# EasyEDA Pro project ACDC_双向.eprj, board 全桥（SMC）
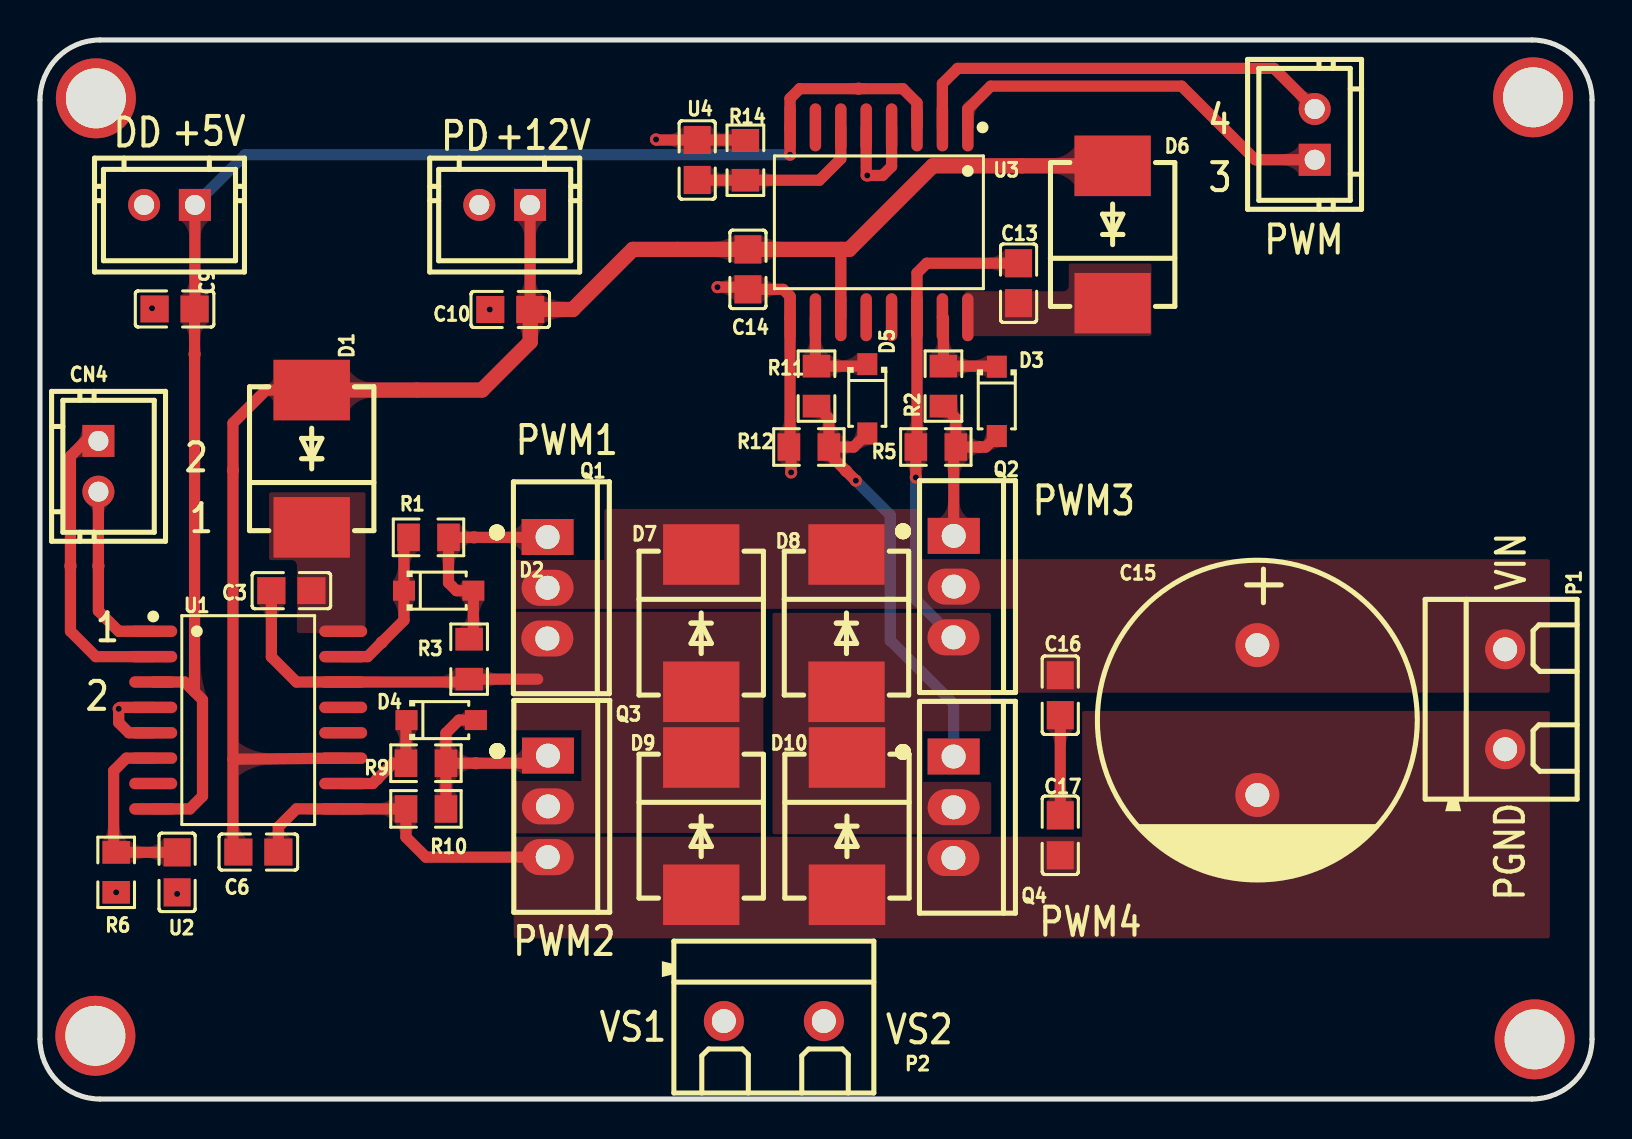
[diagram p5: board, top side]
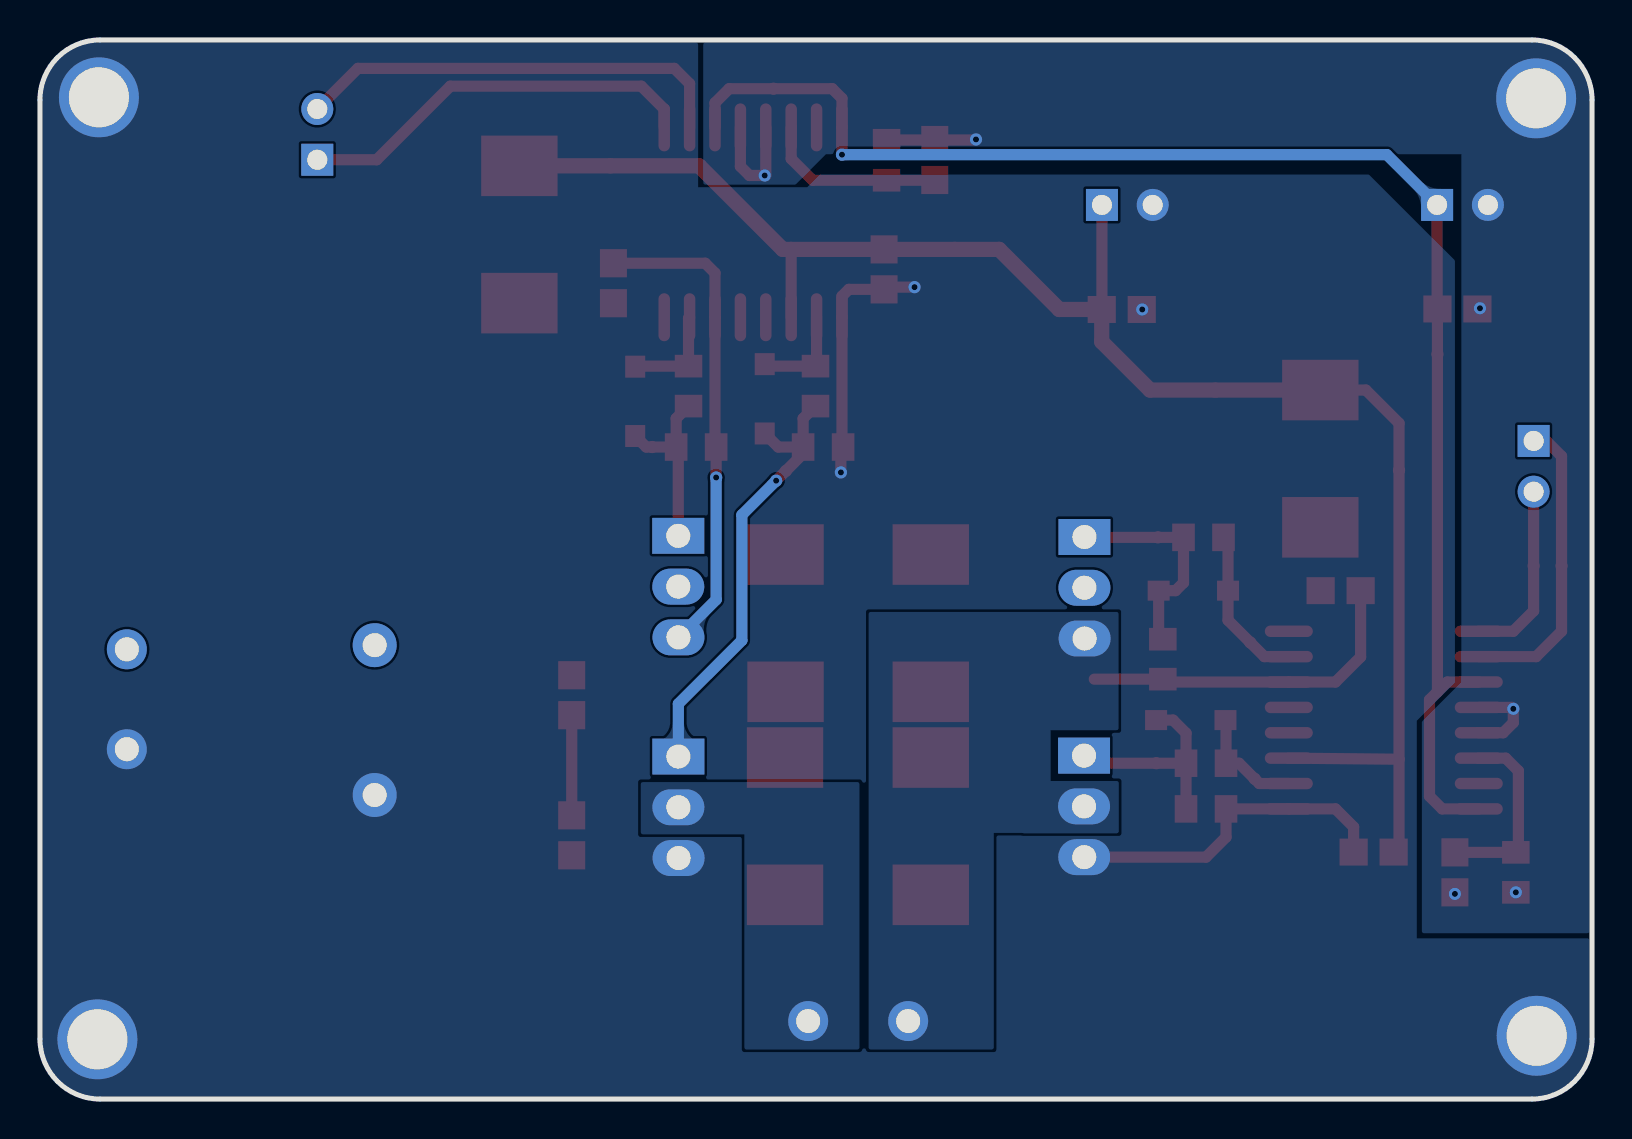
[diagram p6: board, bottom side, seen from below]

Outline 77.62 x 53 mm; copper layers: Top Layer, Bottom Layer. Coordinates in mm from the lower left corner of the outline.
Outline path: 0,50 0,3 arc(0.88,0.88) 3,0 74.62,0 arc(76.74,0.88) 77.62,3 77.62,50 arc(76.74,52.12) 74.62,53 3,53 arc(0.88,52.12) 0,50
Stack: Top Layer 0.035mm / Dielectric1 1.51mm FR4 er 4.5 / Bottom Layer 0.035mm

## Design rules (mm)
template: 自定义配置
spacing copperThickness1oz (default): track to track 0.102, other pairs 0.152 to 0.3
spacing copperThickness2oz: track to track 0.203, other pairs 0.152 to 0.3
track width copperThickness1oz (default): min 0.127, default 0.254, max 25.4
track width copperThickness2oz: min 0.203, default 0.254, max 2.54
differential pair differentialPair (default): width min 0.127, default 0.254, max 2.54; gap min 0.152, default 0.152
via viaSize (default): diameter min 0.5, default 0.61, max 10; hole min 0.3, default 0.305, max 6.299

## Placement (name value [footprint] x y rotation side)
C3  1uF  [C0805]  12.57 25.44 0 top
C6  1uF  [C0805]  10.92 12.36 180 top
C9  100nF  [C0805]  6.73 39.54 0 top
C10  100nF  [C0805]  23.52 39.51 0 top
C13  1uF  [C0805]  48.94 40.83 270 top
C14  1uF  [C0805]  35.41 41.52 90 top
C15  470uF  [CAP-TH_BD16.0-P7.50-D1.2-FD]  60.88 18.96 270 top
C16  100nF  [C0805]  51.03 20.21 90 top
C17  100nF  [C0805]  51.03 13.2 90 top
CN1  CON2-2.54*2P  [CONN-TH_2P-P2.54-V]  6.48 44.74 180 top
CN2  CON2-2.54*2P  [CONN-TH_2P-P2.54-V]  63.75 48.28 90 top
CN3  CON2-2.54*2P  [CONN-TH_2P-P2.54-V]  23.24 44.74 180 top
CN4  CON2-2.54*2P  [CONN-TH_2P-P2.54-V]  2.92 31.66 270 top
D1  RS3MC  [SMC_L7.1-W6.2-LS8.1-R-RD]  13.59 32.04 90 top
D2  1N4148W  [SOD-123F_L2.7-W1.6-LS3.8-RD]  19.94 25.44 0 top
D3  1N4148W  [SOD-123F_L2.7-W1.6-LS3.8-RD]  47.85 34.91 270 top
D4  1N4148W  [SOD-123F_L2.7-W1.6-LS3.8-RD]  20.07 18.96 0 top
D5  1N4148W  [SOD-123F_L2.7-W1.6-LS3.8-RD]  41.38 35.04 270 top
D6  RS3MC  [SMC_L7.1-W6.2-LS8.1-R-RD]  53.65 43.27 90 top
D7  SK106C  [SMC_L7.1-W6.2-LS8.1-R-RD]  33.07 23.82 270 top
D8  SK106C  [SMC_L7.1-W6.2-LS8.1-R-RD]  40.33 23.82 270 top
D9  SK106C  [SMC_L7.1-W6.2-LS8.1-R-RD]  33.07 13.66 270 top
D10  SK106C  [SMC_L7.1-W6.2-LS8.1-R-RD]  40.36 13.66 270 top
NOREF  -  [Pad_e246]  2.77 3.16 0 top
NOREF#2  -  [Pad_e149]  16.87 16.02 0 top
NOREF#3  -  [Pad_e243]  74.68 50.13 0 top
NOREF#4  -  [Pad_e84]  1.52 26.68 0 top
NOREF#5  -  [Pad_e155]  21.79 16.8 0 top
NOREF#6  -  [Pad_e193]  40.32 31.43 0 top
NOREF#7  -  [Pad_e245]  2.79 50.08 0 top
NOREF#8  -  [Pad_e48]  7.73 37.27 0 top
NOREF#9  -  [Pad_e11]  31.88 42.52 0 top
NOREF#10  -  [Pad_e56]  40.94 50.56 0 top
NOREF#11  -  [Pad_e161]  17.09 22.85 0 top
NOREF#12  -  [Pad_e7]  18.56 35.48 0 top
NOREF#13  -  [Pad_e132]  9.65 31.46 0 top
NOREF#14  -  [Pad_e177]  21.71 28.11 0 top
NOREF#15  -  [Pad_e140]  49.09 46.7 0 top
NOREF#16  -  [Pad_e118]  18.84 35.48 0 top
NOREF#17  -  [Pad_e68]  2.92 26.68 0 top
NOREF#18  -  [Pad_e247]  74.75 2.99 0 top
NOREF#19  -  [Pad_e199]  47.01 32.63 0 top
P1  KF301-2P接线端子  [CONN-TH_XY301V-A-5.0-2P]  73.28 20.01 270 top
P2  KF301-2P接线端子  [CONN-TH_XY301V-A-5.0-2P]  36.7 3.9 180 top
Q1  CSD19536KCS  [TO-220-3_L10.0-W4.5-P2.54-L]  25.38 25.59 270 top
Q2  CSD19536KCS  [TO-220-3_L10.0-W4.5-P2.54-L]  45.69 25.64 270 top
Q3  CSD19536KCS  [TO-220-3_L10.0-W4.5-P2.54-L]  25.4 14.65 270 top
Q4  CSD19536KCS  [TO-220-3_L10.0-W4.5-P2.54-L]  45.69 14.6 270 top
R1  2Ω  [R0805]  19.43 28.11 0 top
R2  2Ω  [R0805]  45.19 35.68 270 top
R3  10kΩ  [R0805]  21.46 22.01 90 top
R5  10kΩ  [R0805]  44.81 32.63 0 top
R6  20kΩ  [R0805]  3.81 11.34 90 top
R9  2Ω  [R0805]  19.3 16.8 0 top
R10  10kΩ  [R0805]  19.3 14.52 0 top
R11  2Ω  [R0805]  38.84 35.68 270 top
R12  10kΩ  [R0805]  38.46 32.63 0 top
R14  20kΩ  [R0805]  35.28 46.98 270 top
U1  UCC21520  [SOIC-16_L10.3-W7.5-P1.27-LS10.3-BL]  10.41 18.96 270 top
U2  100nF  [C0805]  6.86 11.34 90 top
U3  UCC21520  [SOIC-16_L10.3-W7.5-P1.27-LS10.3-BL]  41.96 43.87 180 top
U4  100nF  [C0805]  32.87 46.99 270 top

## Footprints (pads in the part's own frame, mm; a bottom-side part is the same pattern mirrored in y, then rotated)
C0805
  rect 1.41x1.35 smd: 1(-1,0) 2(1,0)
CAP-TH_BD16.0-P7.50-D1.2-FD
  round 2.2 hole 1.2: 1(-3.75,0) 2(3.75,0)
CONN-TH_2P-P2.54-V
  rect 1.6x1.6 hole 1: 1(-1.27,0)
  round 1.6 hole 1: 2(1.27,0)
CONN-TH_XY301V-A-5.0-2P
  round 2 hole 1.2: 1(-2.5,0) 2(2.5,0)
Pad_e7
  round 0.61 smd: TP1(0,0)
Pad_e11
  round 0.61 smd: TP2(0,0)
Pad_e48
  round 0.61 smd: TP3(0,0)
Pad_e56
  round 0.61 smd: TP4(0,0)
Pad_e68
  round 0.61 smd: TP5(0,0)
Pad_e84
  round 0.61 smd: TP6(0,0)
Pad_e118
  round 0.61 smd: TP9(0,0)
Pad_e132
  round 0.61 smd: TP10(0,0)
Pad_e140
  round 0.61 smd: TP11(0,0)
Pad_e149
  round 0.61 smd: TP12(0,0)
Pad_e155
  round 0.61 smd: TP13(0,0)
Pad_e161
  round 0.61 smd: TP14(0,0)
Pad_e177
  round 0.61 smd: TP15(0,0)
Pad_e193
  round 0.61 smd: TP16(0,0)
Pad_e199
  round 0.61 smd: TP17(0,0)
Pad_e243
  round 4 hole 3: 1(0,0)
Pad_e245
  round 4 hole 3: 1(0,0)
Pad_e246
  round 4 hole 3: 1(0,0)
Pad_e247
  round 4 hole 3: 1(0,0)
R0805
  rect 1.133x1.377 smd: 1(-1,0) 2(1,0)
SMC_L7.1-W6.2-LS8.1-R-RD
  rect 3.03x3.82 smd: 1(3.435,0) 2(-3.435,0)
SOD-123F_L2.7-W1.6-LS3.8-RD
  rect 1.1x1 smd: 1(-1.735,0) 2(1.735,0)
SOIC-16_L10.3-W7.5-P1.27-LS10.3-BL
  oval 0.574x2.401 smd: 1(-4.445,-4.75) 2(-3.175,-4.75) 3(-1.905,-4.75) 4(-0.635,-4.75) 5(0.635,-4.75) 6(1.905,-4.75) 7(3.175,-4.75) 8(4.445,-4.75) 9(4.445,4.75) 10(3.175,4.75) 11(1.905,4.75) 12(0.635,4.75) 13(-0.635,4.75) 14(-1.905,4.75) 15(-3.175,4.75) 16(-4.445,4.75)
TO-220-3_L10.0-W4.5-P2.54-L
  rect 1.8x2.6 hole 1.2: 1(-2.54,0.005)
  oval 1.8x2.6 hole 1.2: 2(0,0.005) 3(2.54,-0.005)

## Nets
+5V: C9.2 CN1.1 NOREF#8.TP3 NOREF#10.TP4 U1.3 U1.8 U3.3 U3.8
+12V: C6.2 C10.2 C14.2 CN3.1 D1.1 D6.1 NOREF#9.TP2 NOREF#12.TP1 NOREF#13.TP10 NOREF#15.TP11 NOREF#16.TP9 U1.11 U3.11
+VIN: C15.1 C16.2 D7.2 D8.2 P1.1 Q1.2 Q2.2
DGND: C9.1 CN1.2 NOREF#7.1 R6.1 R14.1 U1.4 U1.5 U2.1 U3.4 U3.5 U4.1
PGND: C6.1 C10.1 C14.1 C15.2 C17.1 CN3.2 D9.1 D10.1 NOREF.1 NOREF#3.1 NOREF#18.1 P1.2 Q3.3 Q4.3 R10.1 R12.1 U1.9 U3.9
H1: D2.1 NOREF#11.TP14 R1.1 U1.15
H2: D3.1 R2.1 U3.15
L1: D4.1 NOREF#2.TP12 R9.1 U1.10
L2: D5.1 R11.1 U3.10
PWM1: CN4.2 NOREF#17.TP5 U1.1
PWM2: CN4.1 NOREF#4.TP6 U1.2
PWM3: CN2.1 U3.1
PWM4: CN2.2 U3.2
VS1: C3.1 D7.1 D9.2 P2.2 Q1.3 Q3.2 R3.1 U1.14
VS2: C13.1 D8.1 D10.2 P2.1 Q2.3 Q4.2 R5.1 U3.14
$1N1981: D4.2 NOREF#5.TP13 Q3.1 R9.2 R10.2
$1N1983: D2.2 NOREF#14.TP15 Q1.1 R1.2 R3.2
$1N1985: D3.2 NOREF#19.TP17 Q2.1 R2.2 R5.2
$1N1987: D5.2 NOREF#6.TP16 Q4.1 R11.2 R12.2
$1N1994: R14.2 U3.6 U4.2
$1N2002: R6.2 U1.6 U2.2
$1N2012: C13.2 D6.2 U3.16
$1N2013: C3.2 D1.2 U1.16
$1N8248: C16.1 C17.2

Pads without a net: U1 7 12 13; U3 7 12 13

## Via types
v1: diameter 0.61, hole 0.305, Top Layer to Bottom Layer, 12 vias

## Routing (per net, layer and track width the routed paths; a pad name or vN(x,y) marks a point on that pad's centre or on a via; arc(x,y) is an arc through that point)
+5V: length 76.5
  Top Layer w0.559: v1(37.51,47.26) U3.8 37.51,50.08 38,50.56 NOREF#10.TP4 43.15,50.56 43.86,49.85 U3.3 ; U1.8 7.49,14.52 8.13,15.15 8.13,19.98 7.73,20.38 ; CN1.1 7.75,39.55 C9.2 NOREF#8.TP3 7.73,20.38 7.73,20.38 ; U1.3 7.24,20.87 7.73,20.38
  Bottom Layer w0.559: v1(37.51,47.26) 10.26,47.26 CN1.1
+12V: length 86
  Top Layer w0.559: C10.2 24.51,39.52 CN3.1 ; 9.65,17.01 9.65,12.63 C6.2 ; 9.65,17.01 NOREF#13.TP10 9.65,33.82 11.31,35.48 D1.1 ; 9.65,17.01 U1.11 ; U3.11 40.05,42.51 40.06,42.52
  Top Layer w0.762: D6.1 NOREF#15.TP11 44.65,46.7 40.47,42.52 C14.2 NOREF#9.TP2 29.65,42.52 26.64,39.51 C10.2 24.52,37.9 22.1,35.48 NOREF#16.TP9 D1.1
DGND: length 14.6
  Top Layer w0.559: U1.4 4.01,19.6 v1(3.94,19.53) 3.94,18.84 4.44,18.33 5.66,18.33 ; U4.1 35.27,47.99 R14.1 ; U3.5 41.32,46.22 42.14,46.22 42.59,46.67 U3.4 ; 32.82,47.99 30.84,47.99 v1(30.81,48.02)
  vias: v1(3.81,10.34) v1(5.6,39.57) v1(6.86,10.27) v1(41.38,46.22)
PGND: length 29.7
  Top Layer w0.559: C6.1 11.92,13.61 12.83,14.52 U1.9 R10.1 18.3,13.11 19.3,12.11 Q3.3 ; v1(33.88,40.63) 35.3,40.63 C14.1 37.17,40.52 37.51,40.18 U3.9 37.51,32.69 R12.1 37.57,32.52 v1(37.57,31.36) ; C10.1 v1(22.5,39.51)
H1: length 8
  Top Layer w0.559: U1.15 16.38,22.14 NOREF#11.TP14 18.2,23.96 D2.1 18.2,27.88 R1.1
H2: length 5.1
  Top Layer w0.559: U3.15 45.19,39.07 R2.1 47.83,36.68 D3.1
L1: length 5.7
  Top Layer w0.559: D4.1 18.3,18.94 R9.1 17.65,16.8 NOREF#2.TP12 16.64,15.79 U1.10
L2: length 5.1
  Top Layer w0.559: D5.1 41.28,36.68 R11.1 38.78,36.73 U3.10
PWM1: length 9.1
  Top Layer w0.559: CN4.2 NOREF#17.TP5 2.92,24.42 3.94,23.41 U1.1
PWM2: length 15.1
  Top Layer w0.559: CN4.1 2.29,32.93 1.52,32.17 NOREF#4.TP6 1.52,23.41 2.79,22.14 U1.2
PWM3: length 20.3
  Top Layer w0.559: CN2.1 60.78,47.01 57.1,50.69 47.55,50.69 46.4,49.54 U3.1
PWM4: length 22
  Top Layer w0.559: U3.2 45.13,50.81 45.9,51.58 61.72,51.58 CN2.2
VS1: length 17.8
  Top Layer w0.559: C3.1 11.57,22.12 12.83,20.87 U1.14 21.32,20.87 R3.1 24.89,21.01 ; 24.98,22.65 Q1.3
VS2: length 24.3
  Top Layer w0.559: v1(43.81,31.1) R5.1 43.86,32.69 U3.14 43.86,41.34 44.35,41.83 C13.1
  Bottom Layer w0.559: Q2.3 43.81,24.99 v1(43.81,31.1)
$1N1981: length 10.8
  Top Layer w0.559: D4.2 20.95,18.96 20.3,18.31 R9.2 ; Q3.1 25.02,16.8 NOREF#5.TP13 R9.2 ; R10.2 R9.2
$1N1983: length 11.2
  Top Layer w0.559: R3.2 21.67,23.22 D2.2 20.83,25.44 20.43,25.84 R1.2 NOREF#14.TP15 25.37,28.11 Q1.1
$1N1985: length 9.1
  Top Layer w0.559: Q2.1 45.7,32.52 R5.2 ; R5.2 47.3,32.63 D3.2 ; R5.2 45.81,34.06 R2.2
$1N1987: length 22.6
  Top Layer w0.559: 41.38,33.31 40.7,32.63 R12.2 ; R11.2 39.46,34.06 R12.2 ; R12.2 39.46,32.29 NOREF#6.TP16 v1(40.8,30.95)
  Bottom Layer w0.559: Q4.1 45.69,19.78 42.52,22.95 42.52,29.23 v1(40.8,30.95)
$1N1994: length 9.2
  Top Layer w0.559: U3.6 40.05,47.05 38.98,45.98 R14.2 32.88,45.98 U4.2
$1N2002: length 9.4
  Top Layer w0.559: U2.2 R6.2 3.68,12.47 3.68,16.42 4.32,17.06 U1.6
$1N8248: length 5
  Top Layer w0.559: C16.1 C17.2

## Copper pours and planes (outline as drawn; the poured copper is in the pictures)
+VIN on Top Layer: 75.51,20.34 48.77,20.34 48.77,24.53 23.68,24.53 23.68,26.98 28.22,26.98 28.22,29.53 43.99,29.53 43.99,27.02 75.51,27.02
DGND on Bottom Layer: 44.45,45.76 44.45,53.41 -0.38,53.41 -0.38,8.3 8.51,8.3 8.51,18.89 6.53,20.86 6.53,47.28 38.31,47.28 39.84,45.76
PGND on Top Layer: 75.51,19.42 52.12,19.42 52.12,13.13 23.7,13.13 23.7,8.04 75.51,8.04
PGND on Bottom Layer: 44.7,53.25 44.7,45.63 39.25,45.63 38.61,46.27 11.16,46.27 6.86,41.97 6.86,20.84 8.76,18.93 8.76,8.04 -0.46,8.04 -0.46,-0.7 78.03,-0.7 78.03,53.25
VS1 on Top Layer: 23.68,24.37 36.18,24.37 36.18,13.32 28.49,13.32 28.47,13.3 23.66,13.3 23.66,15.91 23.67,15.92 27.08,15.92 27.08,18.46 23.68,18.46
VS1 on Bottom Layer: 29.92,2.48 29.92,13.32 28.49,13.32 28.47,13.3 23.66,13.3 23.66,15.91 23.67,15.92 27.08,15.92 27.08,18.46 23.68,18.46 23.68,24.37 36.18,24.37 36.18,2.48
VS2 on Top Layer: 47.56,24.33 36.63,24.33 36.63,13.25 47.58,13.25 47.58,15.86 47.57,15.87 44.16,15.87 44.16,18.41 47.56,18.41
VS2 on Bottom Layer: 36.63,15.86 47.57,15.86 47.58,15.86 47.58,13.25 42.39,13.25 42.39,2.48 36.63,2.48
$1N2012 on Top Layer: 55.87,42.1 51.17,42.1 51.17,40.7 45.97,40.7 45.97,37.91 55.87,37.91
$1N2013 on Top Layer: 11.18,30.65 11.18,26.69 12.57,26.69 12.57,23.04 16.56,23.04 16.56,30.6 16.51,30.65

Small or netless copper shapes (teardrops, artwork), in the pictures only: 139 on Top Layer, 6 on Bottom Layer

## Text on the board
Top Silkscreen Layer: 2 | 1 | DD | +5V | PD | +12V | PWM2 | PWM1 | VS1 | VS2 | PWM3 | PWM4 | 4 | 3 | PWM | PGND | VIN
